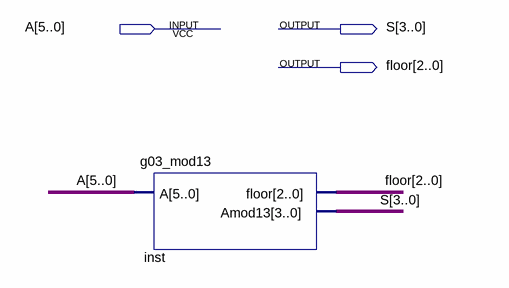
[diagram p0: schematic sheet]
// Quartus schematic g03_lab1.bdf as structural Verilog: 1 symbols, 3 pins
module g03_lab1 (
  input  [5:0] A,
  output [3:0] S,
  output [2:0] floor
);

  g03_mod13 inst (.A(A), .floor(floor), .Amod13(S));
endmodule
